# EAGLE schematic PS (EAGLE 7.7.0)
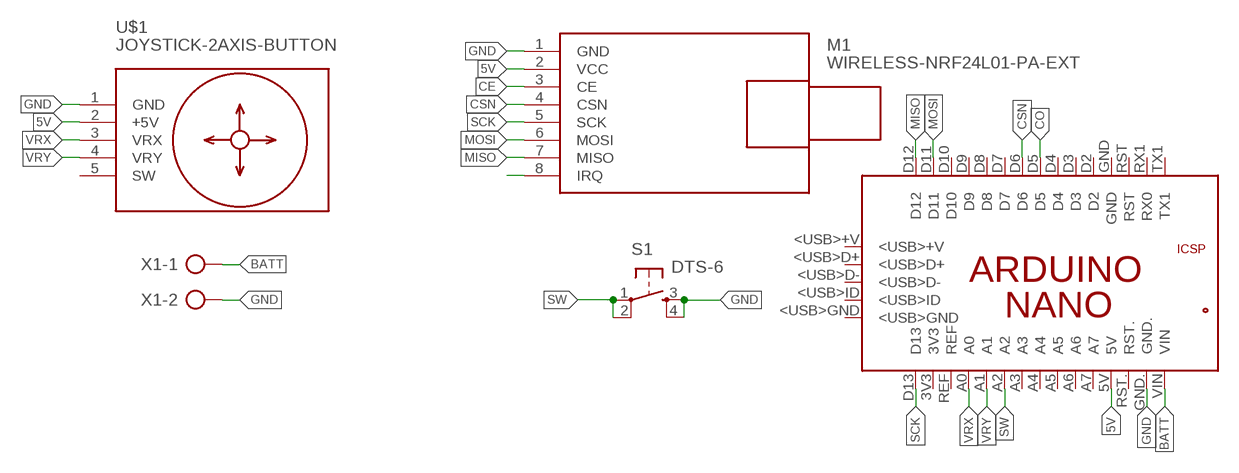
[diagram p0: schematic, sheet 1]

## Parts
M1  WIRELESS-NRF24L01-PA-EXT  [WIRELESS-NRF24L01-PA-EXT]
PCB2  ARDUINO_NANO  [ARDUINO_NANO]
S1  DTS-6  [DTS-6]
U$1  JOYSTICK-2AXIS-BUTTON  [JOYSTICK-2AXIS-BUTTON]
X1  AK300/2  [AK300/2]

## Nets
5V: M1.2(VCC) PCB2.5V U$1.2(+5V)
BATT: PCB2.VIN X1.1
CE: M1.3(CE)
CO: PCB2.D5
CSN: M1.4(CSN) PCB2.D6
GND: M1.1(GND) PCB2.GND. S1.3 S1.4 U$1.1(GND) X1.2
MISO: M1.7(MISO) PCB2.D12
MOSI: M1.6(MOSI) PCB2.D11
N$12: M1.8(IRQ)
SCK: M1.5(SCK) PCB2.D13
SW: PCB2.A2 S1.1 S1.2
VRX: PCB2.A0 U$1.3(VRX)
VRY: PCB2.A1 U$1.4(VRY)
Unconnected: PCB2.3V3 PCB2.5V. PCB2.<USB>+V PCB2.<USB>D+ PCB2.<USB>D- PCB2.<USB>GND PCB2.<USB>ID PCB2.A3 PCB2.A4 PCB2.A5 PCB2.A6 PCB2.A7 PCB2.D2 PCB2.D3 PCB2.D4 PCB2.D7 PCB2.D8 PCB2.D9 PCB2.D10 PCB2.GND PCB2.GND_ PCB2.MISO PCB2.MOSI PCB2.REF PCB2.RESET.. PCB2.RST PCB2.RST. PCB2.RX1(RX0) PCB2.SCK PCB2.TX1 U$1.5(SW)

## Library data of the parts
M1 = diy-modules:WIRELESS-NRF24L01-PA-EXT: 2.4 GHz Wireless Module based on NRF24L01 chip with preamplifier and external antenna Click here to find device on ebay.com <http://www.ebay.com/sch/nrf24l01+pa+lna+sma>
PCB2 = arduino:ARDUINO_NANO: Device for representing an Arduino Nano board with a footprint in an EAGLE design. Created by Dave Young for Element14. More EAGLE documentation at: http://www.element14.com/community/community/knode/cadsoft_eagle
S1 = switch-tact:DTS-6
U$1 = diy-modules:JOYSTICK-2AXIS-BUTTON: 2-Axis Analog Joystick with Push Button Tutorial is available here: http://henrysbench.capnfatz.com/henrys-bench/arduino-sensors-and-input/arduino-ps2-joystick-tutorial-keyes-ky-023-deek-robot/ Click here to find device on ebay.com <http://www.ebay.com/sch/joystick+ps2+module>
X1 = con-ptr500:AK300/2: CONNECTOR; OC_FARNELL: unknown; OC_NEWARK: unknown